# Altium schematic sheet jetson-nano.SchDoc
size A3
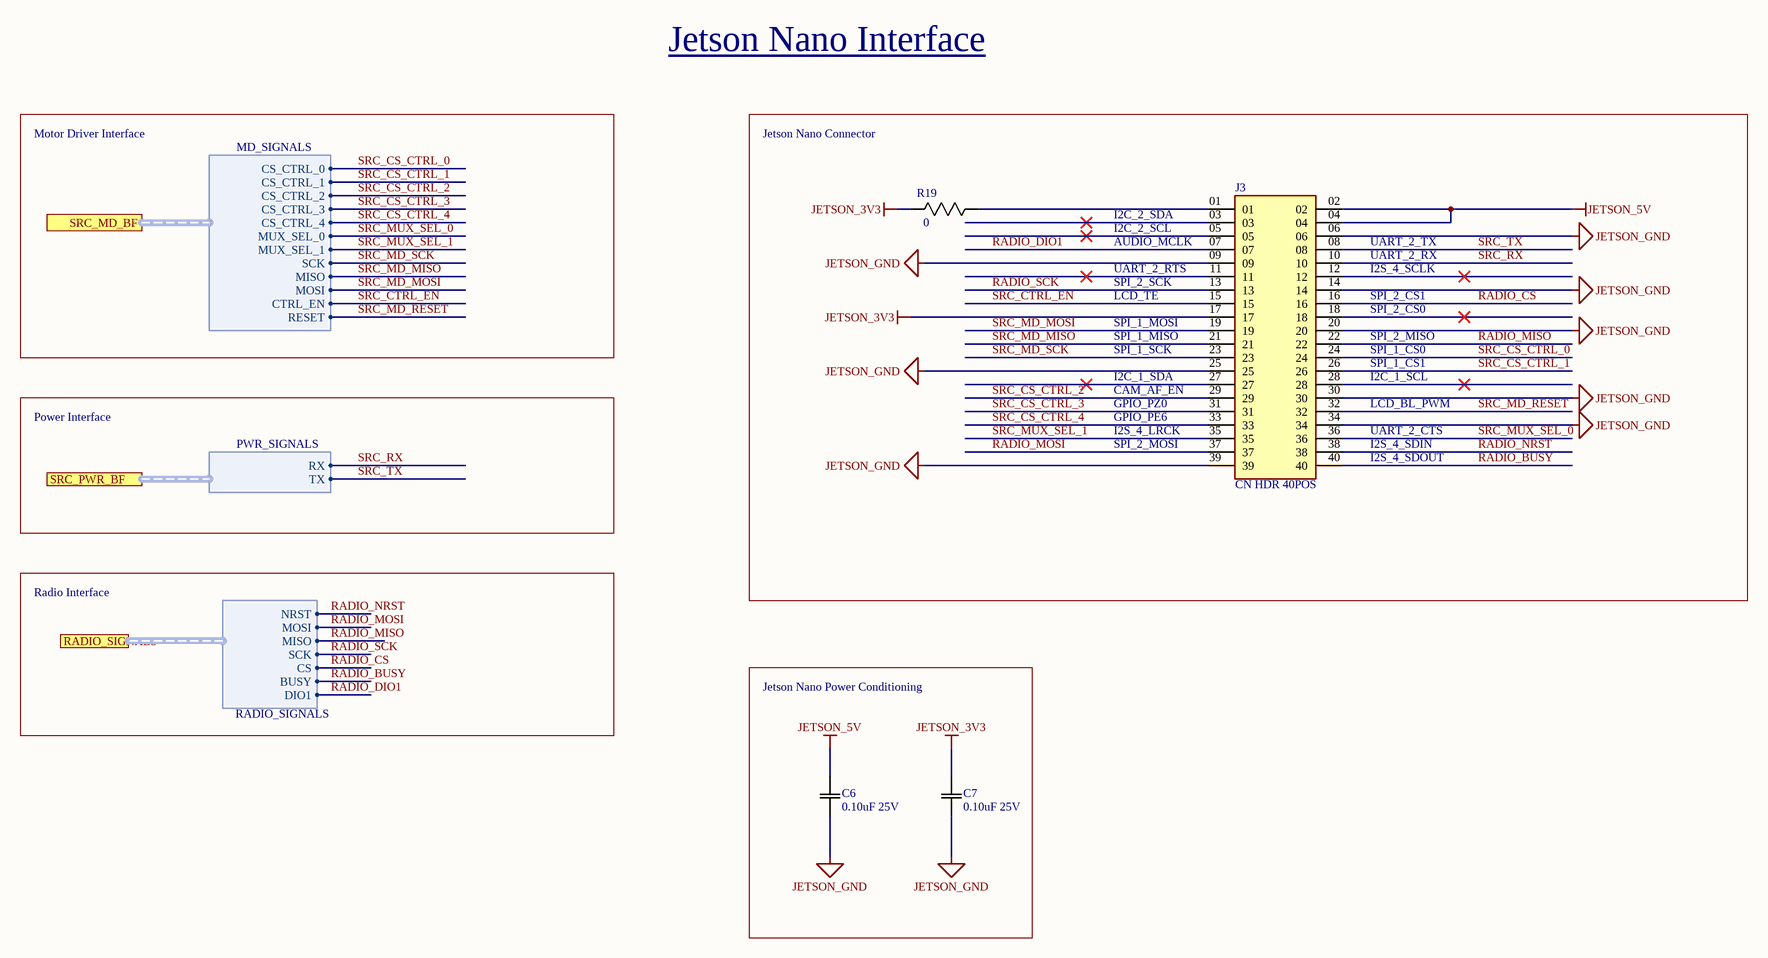
[diagram p0: jetson-nano.SchDoc]

## Parts
C6  0.10uF 25V  [0805]
C7  0.10uF 25V  [0805]
J3  CN HDR 40POS  [CN HDR 40POS 0.1 TH]
R19  0  [0603]

## Blocks framed on the sheet
Jetson Nano Power Conditioning: C6 C7

## Ports
RADIO_SIGNALS (harness RADIO_SIGNALS), SRC_MD_BF (harness MD_SIGNALS), SRC_PWR_BF (harness PWR_SIGNALS)

## Harnesses
PWR_SIGNALS: TX, RX
MD_SIGNALS: CS_CTRL_0, MUX_SEL_1, SCK, MOSI, MISO, CS_CTRL_1, CS_CTRL_2, CS_CTRL_3, CS_CTRL_4, MUX_SEL_0, CTRL_EN, RESET
RADIO_SIGNALS: CS, SCK, MISO, MOSI, NRST, BUSY, DIO1

## Nets
JETSON_3V3: C7.2(C2) J3.17 R19.2(R2)
JETSON_5V: C6.2(C2) J3.02 J3.04
JETSON_GND: C6.1(C1) C7.1(C1) J3.06 J3.09 J3.14 J3.20 J3.25 J3.30 J3.34 J3.39
RADIO_BUSY: J3.40 ; port RADIO_SIGNALS.BUSY
RADIO_CS: J3.16 ; port RADIO_SIGNALS.CS
RADIO_DIO1: J3.07 ; port RADIO_SIGNALS.DIO1
RADIO_MISO: J3.22 ; port RADIO_SIGNALS.MISO
RADIO_MOSI: J3.37 ; port RADIO_SIGNALS.MOSI
RADIO_NRST: J3.38 ; port RADIO_SIGNALS.NRST
RADIO_SCK: J3.13 ; port RADIO_SIGNALS.SCK
SRC_CS_CTRL_0: J3.24 ; port SRC_MD_BF.CS_CTRL_0
SRC_CS_CTRL_1: J3.26 ; port SRC_MD_BF.CS_CTRL_1
SRC_CS_CTRL_2: J3.29 ; port SRC_MD_BF.CS_CTRL_2
SRC_CS_CTRL_3: J3.31 ; port SRC_MD_BF.CS_CTRL_3
SRC_CS_CTRL_4: J3.33 ; port SRC_MD_BF.CS_CTRL_4
SRC_CTRL_EN: J3.15 ; port SRC_MD_BF.CTRL_EN
SRC_MD_MISO: J3.21 ; port SRC_MD_BF.MISO
SRC_MD_MOSI: J3.19 ; port SRC_MD_BF.MOSI
SRC_MD_RESET: J3.32 ; port SRC_MD_BF.RESET
SRC_MD_SCK: J3.23 ; port SRC_MD_BF.SCK
SRC_MUX_SEL_0: J3.36 ; port SRC_MD_BF.MUX_SEL_0
SRC_MUX_SEL_1: J3.35 ; port SRC_MD_BF.MUX_SEL_1
SRC_RX: J3.10 ; port SRC_PWR_BF.RX
SRC_TX: J3.08 ; port SRC_PWR_BF.TX
NetJ3_01: J3.01 R19.1(R1)

Not connected (* = marked no-connect by the designer): J3 03* 05* 11* 12* 18* 27* 28*

## Notes on the sheet
- Jetson Nano Interface
- Motor Driver Interface
- Jetson Nano Connector
- AUDIO_MCLK
- UART_2_RTS
- I2C_2_SDA
- I2C_2_SCL
- I2S_4_SCLK
- UART_2_TX
- UART_2_RX
- LCD_TE
- SPI_2_SCK
- SPI_1_MOSI
- SPI_1_MISO
- SPI_2_CS1
- SPI_2_MISO
- SPI_2_CS0
- GPIO_PZ0
- CAM_AF_EN
- SPI_1_SCK
- I2C_1_SDA
- LCD_BL_PWM
- SPI_1_CS0
- SPI_1_CS1
- I2C_1_SCL
- Power Interface
- SPI_2_MOSI
- I2S_4_LRCK
- GPIO_PE6
- I2S_4_SDIN
- UART_2_CTS
- I2S_4_SDOUT
- Radio Interface

## Library data of the parts
C6 C7 = CAP 0.10uF 25V: CAP CER 0.10UF 25V X7R 0805; Value: 0.1uF; Tolerance: 10%; Temperature Coefficient: X7R; Rating: 25V; Part Number: CAP 0.10uF 25V; Operating Temperature: -55°C ~ 125°C
J3 = CN HDR 40POS: 40 Position Header Connector; Part Number: CN HDR 40POS; Supplier 1: Digi-Key; Supplier Part Number 1: S6104-ND; Supplier URL 1: https://www.digikey.ca/en/products/detail/sullins-connector-solutions/PPTC202LFBN-RC/807240?s=N4IgTCBcDaIMoDYCMAGALAWgHIBEQF0BfIA; Pin Count: 40
R19 = RES 0 JUMPER 0603: Default Resistor Symbol; Power (Watts): 0.125W; Package: 0805; Tolerance: N/A; Value: 0; Part Number: RES 0 JUMPER 0603